# EAGLE design TLCduino (EAGLE 6.0)
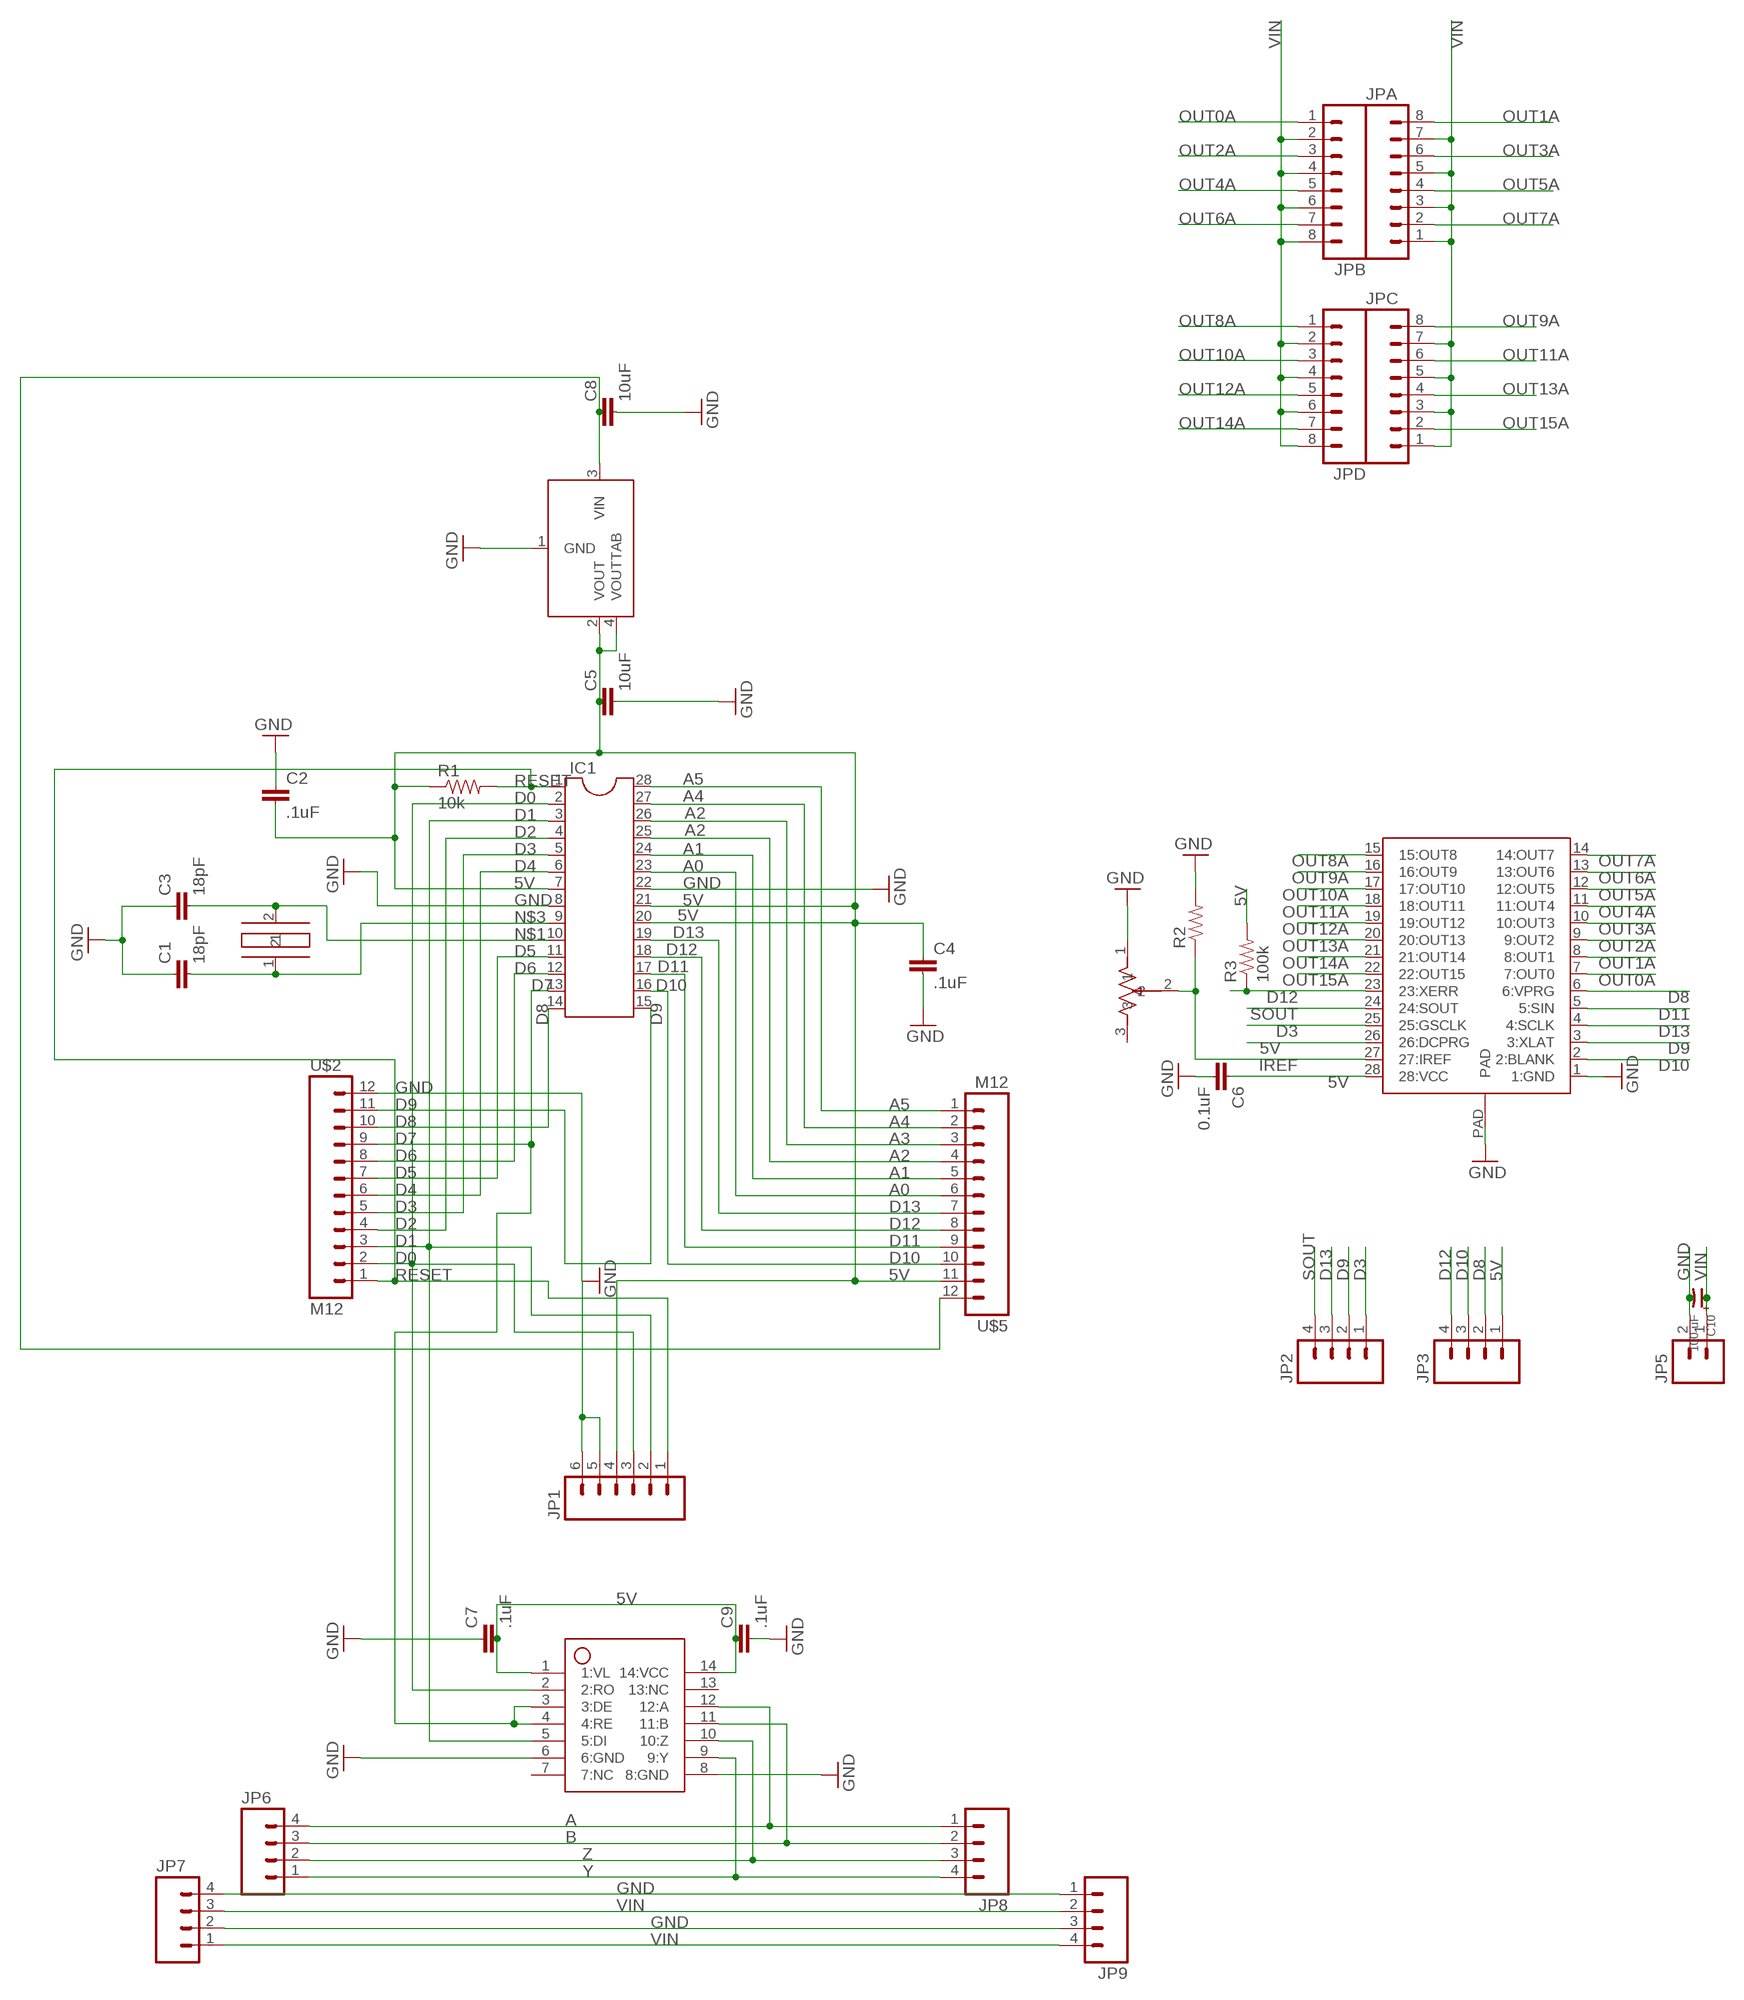
[diagram p0: schematic, sheet 1]

## Parts
5V  ZLDO1117  [ZLDO1117]
C1  18pF  CAP0603-CAP  [0603-CAP]
C2  .1uF  CAP0805  [0805]
C3  18pF  CAP0603-CAP  [0603-CAP]
C4  .1uF  CAP0805  [0805]
C5  10uF  CAP1206  [1206]
C6  0.1uF  CAP0805  [0805]
C7  .1uF  CAP0805  [0805]
C8  10uF  CAP1206  [1206]
C9  .1uF  CAP0805  [0805]
C10  100 uF  CAPPOL-5X11  [5X11MMCAP]
IC1  DIL28-3  [DIL28-3]
JP1  M06LOCK  [1X06_LOCK]
JP2  M04LOCK  [1X04_LOCK]
JP3  M04LOCK  [1X04_LOCK]
JP5  M02LOCK  [1X02_LOCK]
JP6  M04LOCK  [1X04_LOCK]
JP7  M04LOCK  [1X04_LOCK]
JP8  M04LOCK  [1X04_LOCK]
JP9  M04LOCK  [1X04_LOCK]
JPA  M08LOCK  [1X08_LOCK]
JPB  M08LOCK  [1X08_LOCK]
JPC  M08LOCK  [1X08_LOCK]
JPD  M08LOCK  [1X08_LOCK]
R1  10k  RESISTOR  [0805]
R2  RESISTOR  [0805]
R3  100k  RESISTOR  [0805]
U$1  HC49US  [HC49US]
U$2  M12  M12LOCK  [1X12_LOCK]
U$3  TLC5940  [HTSSOP-28]
U$4  TRIMPOTTC33X-2  [TC33X-2]
U$5  M12  M12LOCK  [1X12_LOCK]
U$6  MAX13432  [SO14]

## Nets
5V: 5V.2(VOUT) 5V.4(VOUTTAB) C2.2 C4.1 C5.1 C6.1 C7.2 C9.1 IC1.7 IC1.20 IC1.21 JP1.4 JP3.1 R1.1 R3.2 U$3.26(26:DCPRG) U$3.28(28:VCC) U$5.11 U$6.1(1:VL) U$6.14(14:VCC)
A: JP6.4 JP8.1 U$6.12(12:A)
A0: IC1.23 U$5.6
A1: IC1.24 U$5.5
A2: IC1.25 U$5.4
A3: IC1.26 U$5.3
A4: IC1.27 U$5.2
A5: IC1.28 U$5.1
B: JP6.3 JP8.2 U$6.11(11:B)
D0: IC1.2 JP1.3 U$2.2 U$6.2(2:RO)
D1: IC1.3 JP1.2 U$2.3 U$6.5(5:DI)
D2: IC1.4 U$2.4
D3: IC1.5 JP2.1 U$2.5 U$3.25(25:GSCLK)
D4: IC1.6 U$2.6
D5: IC1.11 U$2.7
D6: IC1.12 U$2.8
D7: IC1.13 U$2.9 U$6.3(3:DE) U$6.4(4:RE)
D8: IC1.14 JP3.2 U$2.10 U$3.6(6:VPRG)
D9: IC1.15 JP2.2 U$2.11 U$3.3(3:XLAT)
D10: IC1.16 JP3.3 U$3.2(2:BLANK) U$5.10
D11: IC1.17 U$3.5(5:SIN) U$5.9
D12: IC1.18 JP3.4 R3.1 U$3.23(23:XERR) U$5.8
D13: IC1.19 JP2.3 U$3.4(4:SCLK) U$5.7
GND: 5V.1(GND) C1.1 C2.1 C3.1 C4.2 C5.2 C6.2 C7.1 C8.2 C9.2 C10.- IC1.8 IC1.22 JP1.5 JP1.6 JP5.2 JP7.2 JP7.4 JP9.1 JP9.3 R2.2 U$2.12 U$3.1(1:GND) U$3.PAD U$4.1 U$6.6(6:GND) U$6.8(8:GND)
IREF: R2.1 U$3.27(27:IREF) U$4.2
N$1: C3.2 IC1.10 U$1.2
N$3: C1.2 IC1.9 U$1.1
OUT0A: JPB.1 U$3.7(7:OUT0)
OUT1A: JPA.8 U$3.8(8:OUT1)
OUT2A: JPB.3 U$3.9(9:OUT2)
OUT3A: JPA.6 U$3.10(10:OUT3)
OUT4A: JPB.5 U$3.11(11:OUT4)
OUT5A: JPA.4 U$3.12(12:OUT5)
OUT6A: JPB.7 U$3.13(13:OUT6)
OUT7A: JPA.2 U$3.14(14:OUT7)
OUT8A: JPD.1 U$3.15(15:OUT8)
OUT9A: JPC.8 U$3.16(16:OUT9)
OUT10A: JPD.3 U$3.17(17:OUT10)
OUT11A: JPC.6 U$3.18(18:OUT11)
OUT12A: JPD.5 U$3.19(19:OUT12)
OUT13A: JPC.4 U$3.20(20:OUT13)
OUT14A: JPD.7 U$3.21(21:OUT14)
OUT15A: JPC.2 U$3.22(22:OUT15)
RESET: IC1.1 JP1.1 R1.2 U$2.1
SOUT: JP2.4 U$3.24(24:SOUT)
VIN: 5V.3(VIN) C8.1 C10.+ JP5.1 JP7.1 JP7.3 JP9.2 JP9.4 JPA.1 JPA.3 JPA.5 JPA.7 JPB.2 JPB.4 JPB.6 JPB.8 JPC.1 JPC.3 JPC.5 JPC.7 JPD.2 JPD.4 JPD.6 JPD.8 U$5.12
Y: JP6.1 JP8.4 U$6.9(9:Y)
Z: JP6.2 JP8.3 U$6.10(10:Z)
Unconnected: U$4.3 U$6.7(7:NC) U$6.13(13:NC)

## Library data of the parts
5V = 1dah:ZLDO1117
C1-C9 = 1dah:CAP: Capacitor Standard 0402 ceramic capacitor, and 0.1" leaded capacitor.
C10 = 1dah:CAPPOL
IC1 = 1dah:DIL28: Dual In Line
JP1 = 1dah:M06: Header 6 Standard 6-pin 0.1" header. Use with straight break away headers (SKU : PRT-00116), right angle break away headers (PRT-00553), swiss pins (PRT-00743), machine pins (PRT-00117), and female headers (PRT-00115). Molex polarized connector foot print use with SKU : PRT-08094 with associated crimp pins and housings. NOTES ON THE VARIANTS LOCK and LOCK_LONGPADS... This footprint was designed to help hold the alignment of a through-hole component (i.e. 6-pin header) while soldering it into place. You may notice that each hole has been shifted either up or down by 0.005 of an inch from it's more standard position (which is a perfectly straight line). This slight alteration caused the pins (the squares in the middle) to touch the edges of the holes. Because they are alternating, it causes a "brace" to hold the component in place. 0.005 has proven to be the perfect amount of "off-center" position when using our standard breakaway headers. Although looks a little odd when you look at the bare footprint, once you have a header in there, the alteration is very hard to notice. Also, if you push a header all the way into place, it is covered up entirely on the bottom side. This idea of altering the position of holes to aid alignment will be further integrated into the Sparkfun Library for other footprints. It can help hold any component with 3 or more connection pins.
JP2 JP3 JP6-JP9 = 1dah:M04: Header 4 Standard 4-pin 0.1" header. Use with straight break away headers (SKU : PRT-00116), right angle break away headers (PRT-00553), swiss pins (PRT-00743), machine pins (PRT-00117), and female headers (PRT-00115). Molex polarized connector foot print use with SKU : PRT-08231 with associated crimp pins and housings.
JP5 = 1dah:M02: Header 2 Standard 2-pin 0.1" header. Use with straight break away headers (SKU : PRT-00116), right angle break away headers (PRT-00553), swiss pins (PRT-00743), machine pins (PRT-00117), and female headers (PRT-00115). Molex polarized connector foot print use with SKU : PRT-08233 with associated crimp pins and housings.
JPA JPB JPC JPD = 1dah:M08: Header 8 Standard 8-pin 0.1" header. Use with straight break away headers (SKU : PRT-00116), right angle break away headers (PRT-00553), swiss pins (PRT-00743), machine pins (PRT-00117), and female headers (PRT-00115).
R1-R3 = 1dah:RESISTOR: Resistor Basic schematic elements and footprints for 0603, 1206, and PTH 1/10th watt (small) resistors.
U$1 = 1dah:HC49US: 16 MHz crystal
U$2 U$5 = 1dah:M12: Header 12 Standard 12-pin 0.1" header. Use with straight break away headers (SKU : PRT-00116), right angle break away headers (PRT-00553), swiss pins (PRT-00743), machine pins (PRT-00117), and female headers (PRT-00115).
U$3 = 1dah:TLC5940
U$4 = 1dah:TRIMPOT: Bournes Trimpot
U$6 = 1dah:MAX13432: Full duplex RS285 interface

## Board
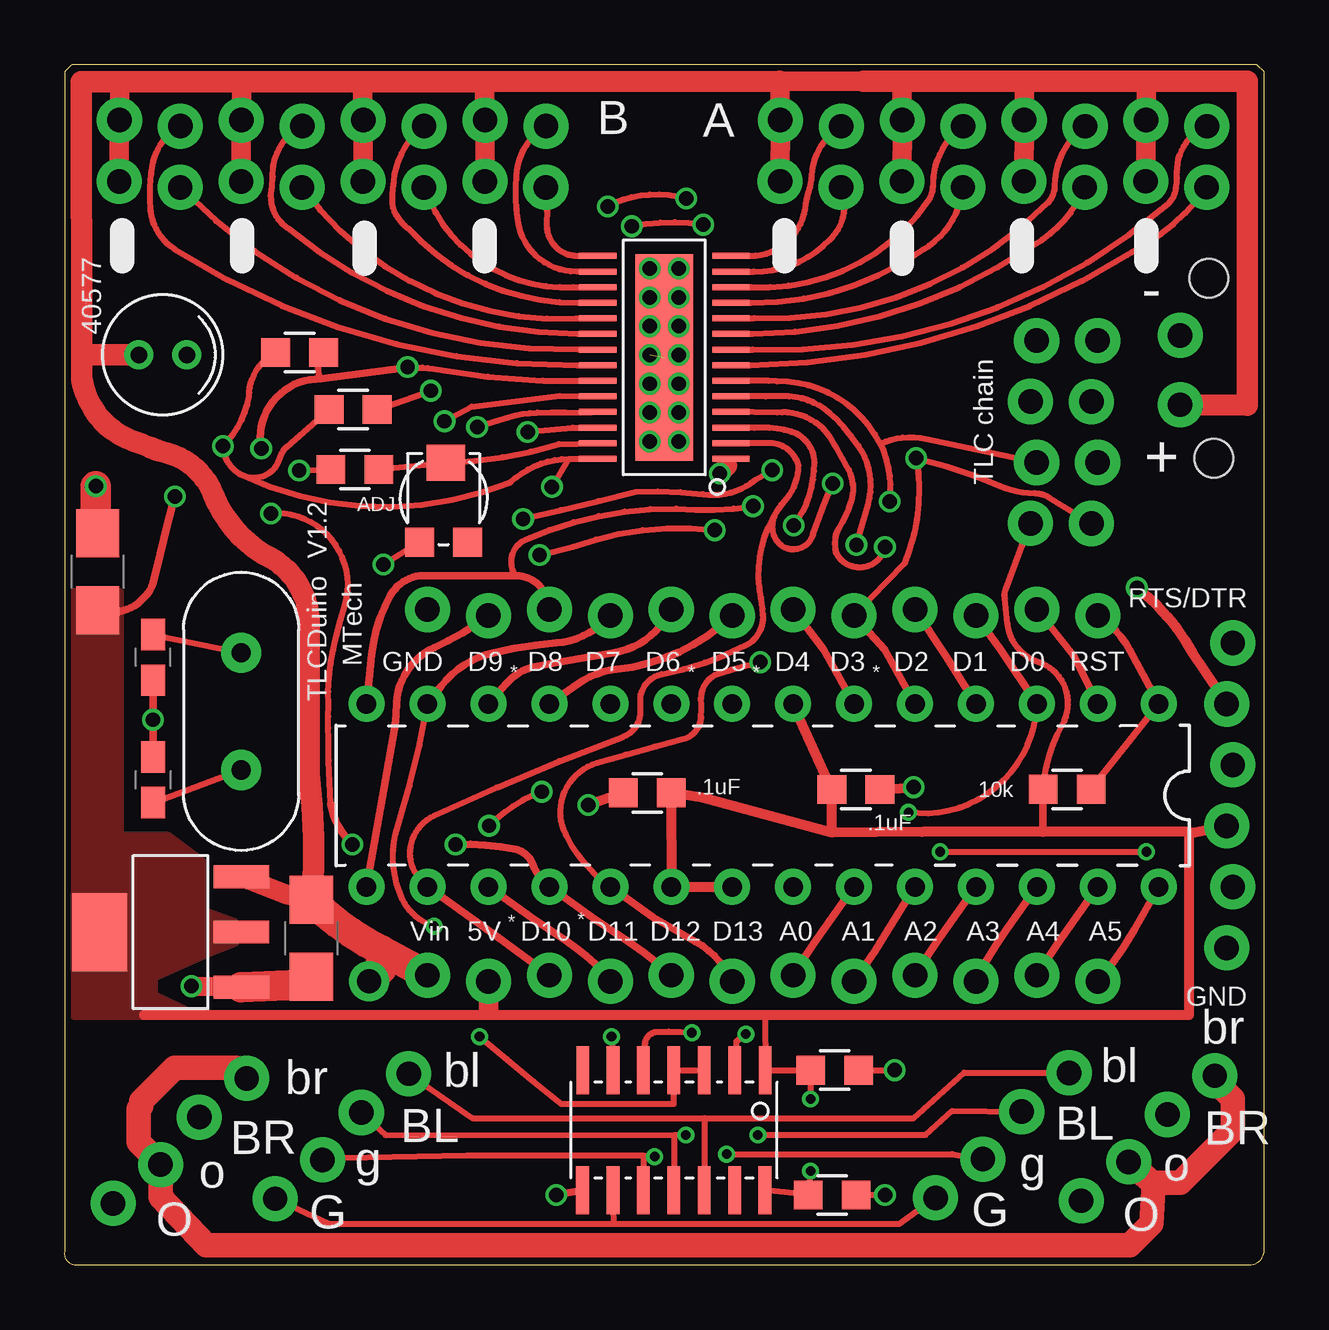
[diagram p1: board, top side]
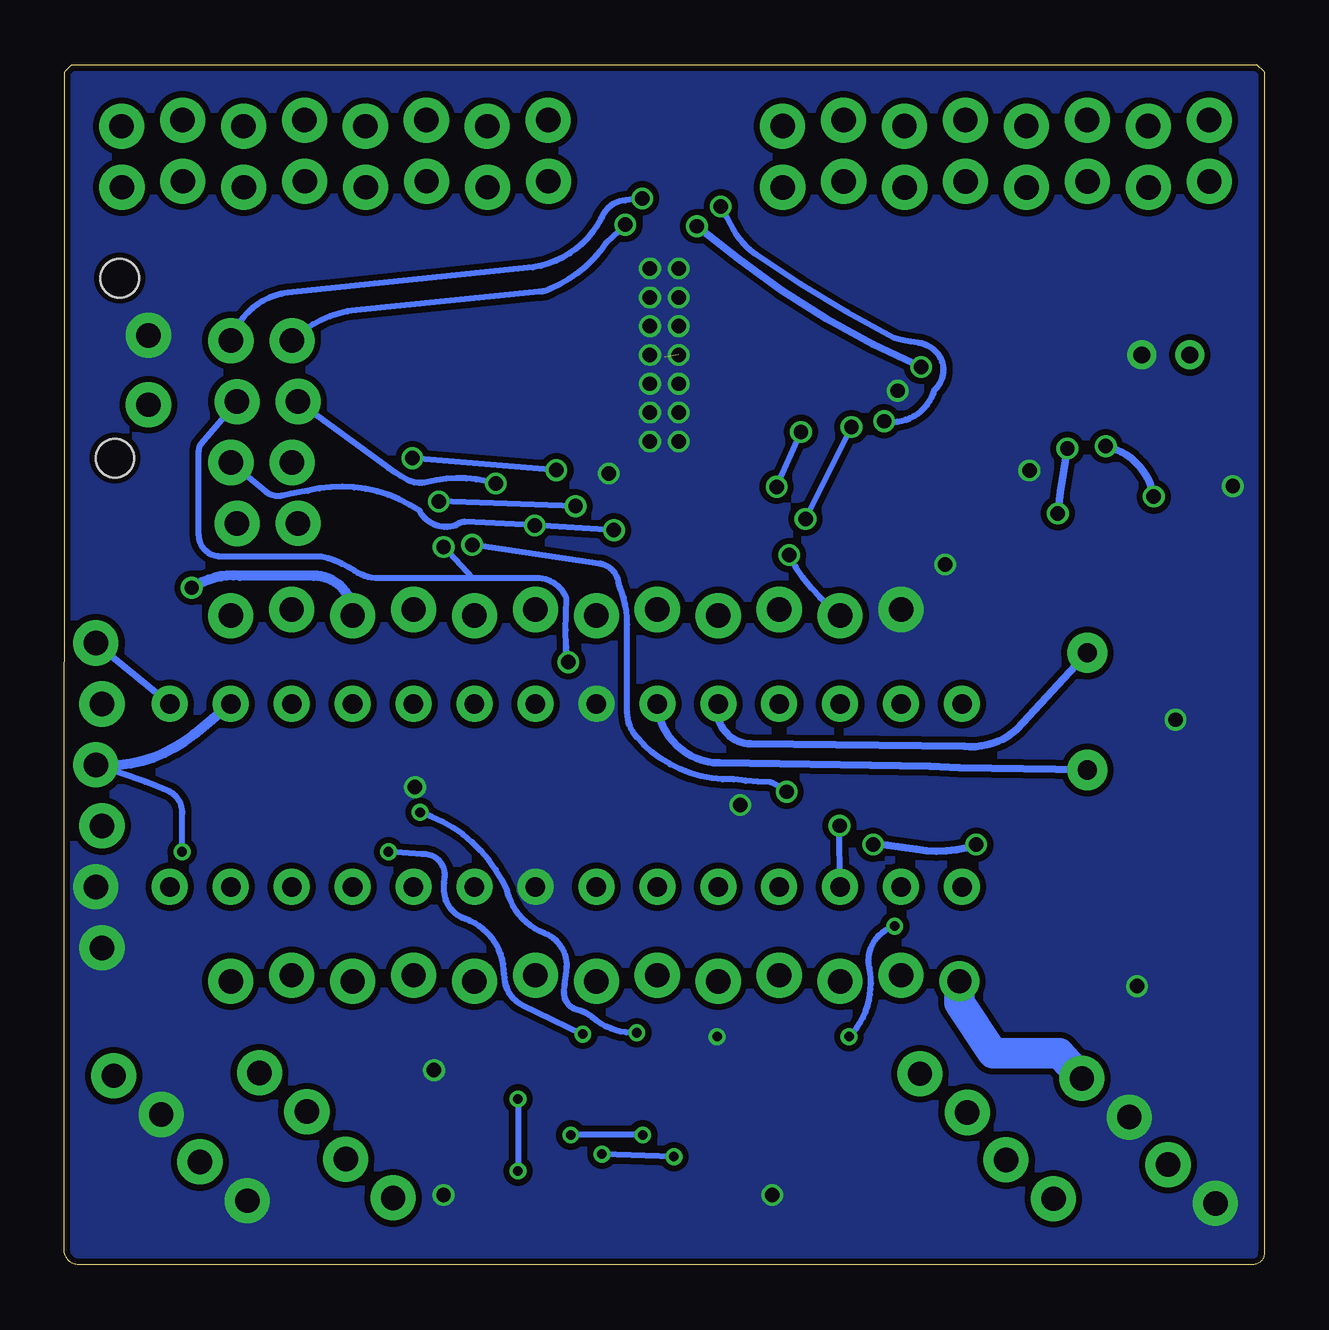
[diagram p2: board, bottom side, seen from below]

Size 50.01 x 50.01 mm. Coordinates in mm from the lower left corner, seen from the top.
Outline: 0,49.71 0.01,0.54 arc93 0.41,0.01 49.3,0.01 arc90 50.01,0.52 50,49.71
Outline: 49.71,50.01 0.31,50.01
Outline: 0,49.71 0.3,50.01
Outline: 49.7,50.01 50,49.71
Copper layers (1*16): Top 0.035mm / dielectric 1.5mm / Bottom 0.035mm
Design rules: minimum track width 6mil, minimum drill 12mil, track to track 6mil, track to pad 6mil, pad to pad 6mil, via to via 6mil, smd to smd 0mil, copper to edge 10mil, drill to drill 10mil, minimum pad ring 10mil, minimum via ring 6mil, stop-mask expansion 2mil, vias tented up to drill 100mil, thermal gap 10mil
Holes 1.6 mm at 47.7,41.11 47.9,33.61

### Footprints (pad centres in the part's own frame; a part is rotated, then mirrored left to right if it is on the bottom)
ZLDO1117 = smd 0.95 x 2.3: 1 -2.3,-3; 2 0,-3; 3 2.3,-3 | smd 3.25 x 2.3: 4 0,2.9
0603-CAP = smd 1.3 x 1: 1 -0.95,0; 2 0.95,0
0805 = smd 1.2 x 1.2: 1 -1,0; 2 1,0
1206 = smd 2 x 1.8: 1 -1.6,0; 2 1.6,0
5X11MMCAP = drill 0.7: + 0,-1; - 0,1
DIL28-3 = drill 0.813 pad 1.5: 1 -16.51,-3.81; 2 -13.97,-3.81; 3 -11.43,-3.81; 4 -8.89,-3.81; 5 -6.35,-3.81; 6 -3.81,-3.81; 7 -1.27,-3.81; 8 1.27,-3.81; 9 3.81,-3.81; 10 6.35,-3.81; 11 8.89,-3.81; 12 11.43,-3.81; 13 13.97,-3.81; 14 16.51,-3.81; 15 16.51,3.81; 16 13.97,3.81; 17 11.43,3.81; 18 8.89,3.81; 19 6.35,3.81; 20 3.81,3.81; 21 1.27,3.81; 22 -1.27,3.81; 23 -3.81,3.81; 24 -6.35,3.81; 25 -8.89,3.81; 26 -11.43,3.81; 27 -13.97,3.81; 28 -16.51,3.81
1X06_LOCK = drill 1.016 pad 1.88: 1 0,0.127; 2 2.54,-0.127; 3 5.08,0.127; 4 7.62,-0.127; 5 10.16,0.127; 6 12.7,-0.127
1X04_LOCK = drill 1.016 pad 1.88: 1 0,0.127; 2 2.54,-0.127; 3 5.08,0.127; 4 7.62,-0.127
1X02_LOCK = drill 1.016 pad 1.88: 1 -0.178,0; 2 2.718,0
1X08_LOCK = drill 1.016 pad 1.88: 1 0,0.127; 2 2.54,-0.127; 3 5.08,0.127; 4 7.62,-0.127; 5 10.16,0.127; 6 12.7,-0.127; 7 15.24,0.127; 8 17.78,-0.127
HC49US = drill 0.8 pad 1.676: 1 -2.44,0; 2 2.44,0
1X12_LOCK = drill 1.016 pad 1.88: 1 0,0.127; 2 2.54,-0.127; 3 5.08,0.127; 4 7.62,-0.127; 5 10.16,0.127; 6 12.7,-0.127; 7 15.24,0.127; 8 17.78,-0.127; 9 20.32,0.127; 10 22.86,-0.127; 11 25.4,0.127; 12 27.94,-0.127
HTSSOP-28 = smd 0.25 x 1.55: 1 -4.225,-2.775; 2 -3.575,-2.775; 3 -2.925,-2.775; 4 -2.275,-2.775; 5 -1.625,-2.775; 6 -0.975,-2.775; 7 -0.325,-2.775; 8 0.325,-2.775; 9 0.975,-2.775; 10 1.625,-2.775; 11 2.275,-2.775; 12 2.925,-2.775; 13 3.575,-2.775; 14 4.225,-2.775; 15 4.225,2.775; 16 3.575,2.775; 17 2.925,2.775; 18 2.275,2.775; 19 1.625,2.775; 20 0.975,2.775; 21 0.325,2.775; 22 -0.325,2.775; 23 -0.975,2.775; 24 -1.625,2.775; 25 -2.275,2.775; 26 -2.925,2.775; 27 -3.575,2.775; 28 -4.225,2.775 | smd 8.6 x 2.4: PAD 0,0
TC33X-2 = smd 1.2 x 1.2: 1 -1,-1.8; 3 1,-1.8 | smd 1.6 x 1.5: 2 0.1,1.5
SO14 = smd 0.53 x 2: 1 -3.81,-2.5; 2 -2.54,-2.5; 3 -1.27,-2.5; 4 0,-2.5; 5 1.27,-2.5; 6 2.54,-2.5; 7 3.8,-2.5; 8 3.81,2.5; 9 2.54,2.5; 10 1.27,2.5; 11 0,2.5; 12 -1.27,2.5; 13 -2.54,2.5; 14 -3.8,2.5

### Placement (x,y rotation side)
5V  4.38,13.86 90 top
C1  3.69,20.21 270 top
C2  24.29,19.66 0 top
C3  3.69,25.31 90 top
C4  32.99,19.8 0 top
C5  1.39,28.88 90 top
C6  12.03,35.63 0 top
C7  32,2.91 180 top
C8  10.29,13.6 270 top
C9  32.1,8.11 0 top
C10  4.1,37.91 270 top
IC1  29.11,19.56 180 top
JP1  48.57,25.91 270 top
JP2  42.94,30.89 90 top
JP3  40.4,30.89 90 top
JP5  46.51,36.01 90 top
JP6  36.4,2.7 45 top
JP7  47.86,7.97 225 top
JP8  14.26,8.05 225 top
JP9  2.12,2.47 45 top
JPA  29.84,47.57 0 top
JPB  47.61,45.02 180 top
JPC  2.29,47.57 0 top
JPD  20.07,45.02 180 top
R1  41.79,19.81 0 top
R2  12.1,33.14 180 top
R3  9.8,38.01 180 top
U$1  7.37,23.06 90 top
U$2  43.08,27.18 180 top
U$3  25,37.81 90 top
U$4  15.8,31.91 0 top
U$5  43.08,11.94 180 top
U$6  25.4,5.61 180 top

### Tracks (layer width: path | path; a pad name or v marks a point on that pad's centre or on a via)
5V  (via drill 0.4, 0.6)
  Top 0.254: 21.02,33.58 U$3.28 | 21.02,33.58 arc43 18.6,32.61 arc-47 7.4,32.91 | 7.4,32.91 arc-62 v6.6,34.11 arc36 7.7,36.16 arc-63 R3.2 | JP3.1 39.21,28.08 arc38 39.2,27.76 39.31,26.72 arc65 40.6,25.11 arc-101 41.6,22.51 arc25 R1.1 | C6.1 9.28,34.09 arc33 8.98,33.62 arc-100 7.4,32.91 | U$3.26 21.18,34.88 v19.31,34.7 | 21.02,33.58 v20.32,32.41 | U$6.14 C7.2 v31.1,3.91 | v31.1,6.91 C9.1 U$6.1 29.2,10.41
  Top 0.305: 40.79,18.03 R1.1 | v4.6,32.01 arc2 3.7,28.41 arc-87 C5.1
  Top 0.406: 46.89,18.03 40.79,18.03 35.76,18.03 31.99,18.01 | 46.89,18.03 46.89,10.41 29.2,10.41 17.42,10.41 | 3.31,10.41 17.42,10.41 | 31.99,18.01 C4.1 IC1.7 | IC1.21 IC1.20 C2.2 26.59,19.46 31.99,18.01 | JP1.4 47,18.01 46.89,18.03 | 17.42,10.41 arc53 17.68,10.62
  Top 0.813: 17.68,10.62 U$5.11
  Bottom 0.254: v20.32,32.41 v19.31,34.7 | v31.1,6.91 v31.1,3.91
  Bottom 0.305: v4.6,32.01 arc-68 v6.6,34.11
  pour Top (no thermals): 5.85,12.95 7.12,13.46 7.12,14.22 5.75,14.73 5.75,16.76 4.32,17.83 2.29,17.83 2.29,27.98 0.41,27.98 0.41,10.41 5.35,10.41 3.69,11.21 3.69,12.01
A
  Top 0.254: JP8.1 17,6.11 26.67,6.11 | 26.67,6.11 U$6.12 | 26.67,6.11 35.4,6.11 37.5,8.01 JP6.4
A0
  Top 0.305: IC1.23 31.65,13.97 arc4 U$5.6
A1
  Top 0.305: IC1.24 34.19,13.71 arc-3 U$5.5
A2
  Top 0.305: IC1.25 36.73,13.97 arc4 U$5.4
A3
  Top 0.305: IC1.26 39.27,13.97 arc10 U$5.3
A4
  Top 0.305: IC1.27 41.81,13.97 arc4 U$5.2
A5
  Top 0.305: IC1.28 44.6,13.97 arc-11 U$5.1
B  (via drill 0.4)
  Top 0.254: 25.41,5.41 U$6.11 | 25.41,5.41 13.38,5.4 JP8.2 | 25.41,5.41 v25.9,5.41 | v28.9,5.41 35.9,5.41 37,6.41 JP6.3
  Bottom 0.254: v25.9,5.41 v28.9,5.41
D0  (via drill 0.4)
  Top 0.254: U$6.2 28,9.31 v28.4,9.61 | v36.5,17.21 v45.1,17.21
  Top 0.305: IC1.2 42.06,25.4 U$2.2
  Bottom 0.254: v28.4,9.61 30.9,10.81 arc55 31.63,11.79 arc5 31.69,12.31 arc-67 33.3,14.41 arc68 34.18,15.59 arc10 34.16,16.08 arc-105 35.1,17.11 v36.5,17.21 | v45.1,17.21 45.1,18.71 arc-67 45.6,19.71 arc-6 JP1.3
  Bottom 0.406: IC1.2 44.6,22.11 arc44 JP1.3
D1  (via drill 0.4, 0.6)
  Top 0.254: U$6.5 24.2,9.21 arc-83 24.7,9.71 arc-7 v26.15,9.67 | v35.18,18.85 36,18.81 arc85 IC1.3
  Top 0.305: IC1.3 39.01,25.65 U$2.3
  Top 0.406: JP1.2 47,25.51 arc24 v44.7,28.21
  Bottom 0.254: v26.15,9.67 arc44 28,10.31 arc-28 28.6,10.61 arc80 29.17,11.36 arc6 29.08,12.24 arc-78 29.99,13.81 arc55 31.55,15.58 arc-49 v35.18,18.85
  Bottom 0.406: v44.7,28.21 arc38 42.7,28.71 39.6,28.71 arc92 U$2.3
D2
  Top 0.305: IC1.4 36.73,25.4 U$2.4
D3  (via drill 0.6)
  Top 0.254: U$2.5 35,29.21 arc33 v35.5,33.61 arc-10 39.23,32.36 arc18 40.43,32.15 arc-31 41.05,31.97 JP2.1 | v29.5,33.11 28.8,32.71 arc-49 26.6,32.11 arc10 23.8,32.21 arc-1 v19.12,31.08 | U$3.25 arc4 21.5,35.51 arc4 19.7,35.51 arc15 18.5,35.31 v17.2,34.91
  Top 0.305: IC1.5 34.19,25.65 U$2.5
  Bottom 0.254: v29.5,33.11 v35.5,33.61 | v17.2,34.91 v19.12,31.08
D4
  Top 0.305: IC1.6 31.65,25.65 U$2.6
D5
  Top 0.305: IC1.11 21.4,24.21 arc-30 23,24.81 arc38 U$2.7
D6
  Top 0.305: IC1.12 18.4,24.21 arc-38 19.6,24.91 arc-2 22.9,25.51 arc55 U$2.8
D7  (via drill 0.4)
  Top 0.254: U$6.3 U$6.4 25.4,6.71 20.7,6.71 arc-1 v17.3,9.51 | v15.4,14.11 arc-49 14.1,15.21 arc-43 13.9,18.31 arc9 IC1.13
  Top 0.305: IC1.13 15.7,24.11 arc-40 17.9,25.51 arc-7 20.5,25.91 arc44 U$2.9
  Bottom 0.254: v15.4,14.11 arc-86 16.45,12.37 arc17 16.4,11.5 arc43 v17.3,9.51
D8  (via drill 0.6)
  Top 0.254: U$3.6 28.69,36.84 arc-4 29.7,36.81 arc-64 34,34.21 | v28.7,31.61 arc-14 25.5,31.51 arc24 19.2,30.21 arc97 18.8,28.71 | v34.4,31.81 arc35 34,34.21 | JP3.2 35.9,34.41 arc37 34,34.21
  Top 0.305: IC1.14 12.8,25.41 arc-24 13.6,27.91 arc-65 15.1,28.71 18.8,28.71 arc-90 U$2.10
  Bottom 0.254: v28.7,31.61 v34.4,31.81
D9  (via drill 0.6)
  Top 0.254: v19.8,29.57 21.2,29.91 arc-27 v27.1,30.61 | U$3.3 28.78,34.87 arc-22 30.3,34.71 arc-73 31.26,33.42 arc-37 v30.4,30.81
  Top 0.305: IC1.15 13.7,22.01 arc8 13.85,23.41 arc-64 15.4,25.71 arc13 U$2.11
  Bottom 0.254: U$2.11 arc25 v19.8,29.57 | v27.1,30.61 v30.4,30.81 33.31,30.96 arc-39 33.7,30.81 arc81 35.2,31.41 arc-48 39.86,32.25 arc-6 40.9,32.05 arc54 41.6,32.21 JP2.2
D10  (via drill 0.6)
  Top 0.254: IC1.16 arc-119 15.4,18.71 arc-5 23.3,22.01 arc64 24,22.91 24,23.51 arc-79 24.9,24.61 arc15 28.4,25.81 arc68 29.12,27.09 arc3 29.04,27.8 arc-51 30,31.81 | 30,31.81 arc43 30.6,33.31 arc74 29.38,34.24 arc0 28.93,34.24 U$3.2 | v32.02,32.55 31.6,31.51 arc4 31.2,30.41 arc-137 29.6,30.31 arc-51 29.6,31.21 arc-17 30,31.81
  Top 0.305: IC1.16 16.91,14.48 arc-1 U$5.10
  Bottom 0.254: JP3.3 36.5,33.21 arc-8 35.7,32.71 arc-41 34.9,32.61 | 34.9,32.61 arc31 v32.02,32.55 arc-31 34.9,32.61
D11  (via drill 0.6)
  Top 0.254: v33.01,30 33.5,31.71 arc51 33.1,34.11 arc10 32.1,35.31 arc46 29.94,36.19 arc-2 U$3.5 | v17.7,18.29 arc-26 v19.9,19.71
  Top 0.305: IC1.17 19.45,14.48 20.98,13.46 arc-18 U$5.9
  Bottom 0.254: IC1.17 v17.7,18.29 | v33.01,30 27.73,29.22 arc80 26.89,28.33 arc25 26.55,26.68 arc-1 26.55,23.03 arc-40 26.17,22 arc-51 22.1,20.22 arc-6 20.6,20.11 arc26 v19.9,19.71
D12  (via drill 0.6)
  Top 0.254: 11.1,19.21 arc-3 11,21.91 arc-1 11,23.31 arc-14 11.2,25.61 arc-6 11.7,27.51 arc110 v8.6,31.31 | R3.1 10.7,37.71 arc68 10.7,36.91 | v23.64,43.27 arc-21 v26.63,43.34 | 14.25,37.37 arc14 v14.3,37.41 | 14.45,37.37 arc-14 15.37,37.33 arc12 U$3.23
  Top 0.305: U$5.8 arc9 23.52,13.46 21.99,14.48 IC1.18 arc-32 19.5,16.71 arc58 18.8,17.31 arc14 v16.3,17.51 | v12,17.51 arc-36 11.1,19.21 | v8.2,34.01 arc-102 10.7,36.91 14.25,37.37 14.45,37.37
  Bottom 0.254: v26.63,43.34 27.44,42.57 arc34 29.72,40.69 arc32 30.23,40.54 37.85,39.78 arc-38 JP3.4
  Bottom 0.305: v16.3,17.51 arc8 14.5,17.31 arc-30 v12,17.51 | v8.6,31.31 arc4 v8.2,34.01 | v23.64,43.27 21.9,41.91 arc-15 v14.3,37.41
D13  (via drill 0.6)
  Top 0.254: IC1.19 arc-28 20.9,17.91 arc-100 22.2,20.91 arc-2 25.8,21.91 arc74 26.54,22.85 arc2 26.54,23.59 arc-68 27.2,24.61 arc-7 v29,25.11 | U$3.4 29.7,35.51 arc-60 31.9,34.51 arc-1 32.7,33.11 arc-43 32.8,31.81 arc-13 32.3,30.71 arc51 32.2,29.61 arc139 v34.2,29.91
  Top 0.305: IC1.19 24.53,14.48 26.31,13.46 arc-35 U$5.7
  Bottom 0.254: v29,25.11 arc81 29.1,25.51 arc-10 29.09,25.78 arc6 29.08,27.78 arc-62 30.2,28.61 33,28.61 | JP2.3 44.3,34.21 arc-44 44.4,33.91 44.4,30.41 arc-90 43.5,29.51 39.3,29.51 arc20 37.9,28.91 arc-33 36.9,28.61 33,28.61 | 33,28.61 v34.2,29.91
GND  (via drill 0.4, 0.6)  (1 unrouted)
  Top 0.254: 27.64,33.3 U$3.1 | v9.78,33.09 R2.2 | U$4.1 v13.3,29.18 | C6.2 v15.28,36.42 | C9.2 v34.6,8.11 | C7.1 v34.2,2.91 | v22.8,9.51 U$6.6
  Top 0.305: C1.1 v3.69,22.71 C3.1 | U$6.8 v20.5,2.91
  Top 0.406: C4.2 v35.39,19.9 | v21.84,19.16 C2.1
  Top 0.813: 5V.1 v5.29,11.61 | v27.31,32.97 27.64,33.3
  Top 1.27: 5V.1 9.81,11.66 C8.2 | C5.2 1.31,30.44 v1.31,32.44
  other vias: 24.4,41.51 25.6,41.51 24.4,40.31 25.6,40.31 24.4,39.11 25.6,39.11 24.4,37.91 25.6,37.91 24.4,36.71 25.6,36.71 24.4,35.51 25.6,35.51 24.4,34.31 25.6,34.31
  pour Bottom (isolate 0.254, no thermals): -5.08,-7.61 62.23,-7.61 62.33,52.4 -4.98,52.4
IREF
  Top 0.254: R2.1 U$4.2 arc15 20.6,34.19 U$3.27
N$1
  Top 0.254: C3.2 U$1.2
  Bottom 0.305: U$1.2 10.3,22.31 arc49 12.5,21.61 21.4,21.71 arc100 IC1.10
N$3
  Top 0.254: C1.2 U$1.1
  Bottom 0.305: U$1.1 12.7,20.71 arc-4 16.4,20.81 22.7,20.91 arc85 IC1.9
OUT0A
  Top 0.254: U$3.7 28.57,37.48 arc32 44.5,42.21 arc28 JPB.1
OUT1A
  Top 0.254: U$3.8 28.69,38.13 arc43 46,44.21 arc40 46.33,44.84 arc9 46.37,45.51 arc-68 JPA.8
OUT2A
  Top 0.254: U$3.9 28.68,38.79 arc34 40.4,42.51 arc40 JPB.3
OUT3A
  Top 0.254: U$3.10 28.75,39.44 arc47 41.01,44.27 arc42 41.28,44.95 arc-52 JPA.6
OUT4A
  Top 0.254: U$3.11 28.64,40.08 arc35 35.8,42.31 arc55 JPB.5
OUT5A
  Top 0.254: U$3.12 28.63,40.74 arc59 36.04,44.38 arc31 36.21,45 arc-54 JPA.4
OUT6A
  Top 0.254: U$3.13 28.73,41.38 arc46 31.9,42.71 arc69 JPB.7
OUT7A
  Top 0.254: U$3.14 28.6,42.04 arc86 30.9,44.21 arc-8 31.08,44.88 arc9 31.15,45.39 arc-55 JPA.2
OUT8A
  Top 0.254: U$3.15 21.38,42.04 arc-93 20.1,43.41 arc9 JPD.1
OUT9A
  Top 0.254: JPC.8 arc55 18.84,45.37 arc12 18.9,43.51 arc83 21.35,41.38 U$3.16
OUT10A
  Top 0.254: U$3.17 21.21,40.74 arc-74 JPD.3
OUT11A
  Top 0.254: JPC.6 arc48 13.73,45.14 arc18 13.7,44.01 arc35 14.3,43.21 arc48 21.43,40.08 U$3.18
OUT12A
  Top 0.254: U$3.19 21.31,39.43 arc-57 JPD.5
OUT13A
  Top 0.254: JPC.4 arc55 8.7,45.75 arc-6 8.6,44.51 arc58 9.3,43.21 arc39 21.39,38.79 U$3.20
OUT14A
  Top 0.254: U$3.21 21.41,38.14 arc-47 JPD.7
OUT15A
  Top 0.254: JPC.2 arc48 3.7,45.95 arc17 3.6,43.91 arc51 4.6,42.31 arc33 21.38,37.48 U$3.22
RESET
  Top 0.305: R1.2 IC1.1 44.4,25.61 arc29 U$2.1
  Bottom 0.305: IC1.1 JP1.1
SOUT  (via drill 0.6)
  Top 0.254: v15.84,35.15 16.98,35.76 20.64,36.21 U$3.24 | v22.65,44.1 22.91,44.25 arc-38 v25.92,44.43
  Bottom 0.254: JP2.4 arc64 40.7,40.51 30.48,41.56 arc-55 27.64,43.59 arc64 26.63,44.35 v25.92,44.43 | v15.84,35.15 arc-84 13.72,36.48 arc-72 13.47,37.76 arc-53 14.4,38.41 arc6 15.4,38.61 arc7 21.2,42.11 arc26 22.1,43.11 v22.65,44.1
VIN  (via drill 1 pad 1.68)
  Top 0.813: C8.1 9.29,15.41 5V.3 | 0.71,49.28 0.71,49.25 0.7,45.71 | JPD.2 JPC.7 17.5,49.28 | JPD.4 JPC.5 12.4,49.28 | JPD.6 JPC.3 7.4,49.28 | JPD.8 JPC.1 2.3,49.28 2.2,49.28 | 33.3,49.31 29.8,49.3 JPA.1 JPB.8 | JPB.6 JPA.3 34.9,49.31 | JPB.4 JPA.5 40,49.31 | JPB.2 JPA.7 45.1,49.31
  Top 0.89: 0.71,37.92 0.71,36.91 arc65 3.2,34.21 arc10 4.3,33.81 arc-53 6.2,32.11 arc37 8.3,29.61 arc-68 10.2,26.61 10.2,20.41 arc-13 C8.1 | 0.71,37.92 0.71,49.25 | 0.71,49.28 2.2,49.28 7.4,49.28 12.4,49.28 17.5,49.28 29.8,49.3 | 33.3,49.31 34.9,49.31 40,49.31 45.1,49.31 49.3,49.31 49.3,35.81 JP5.1 | 0.71,37.92 C10.+
  Top 1.016: JP7.1 47.95,7.66 48.7,6.91 48.7,5.61 46.5,3.41 45.4,3.41 | 45.4,3.41 45.34,3.41 JP7.3 | 45.4,3.41 45.3,1.71 44.4,0.81 5.9,0.81 4.01,2.81 JP9.2 4.01,4.21 3.1,5.11 3.1,6.51 3.2,6.61 3.2,6.81 4.6,8.21 7.16,8.21 JP9.4
  Top 1.27: 13.2,13.11 U$5.12 | 13.2,13.11 arc-19 C8.1 | 13.2,13.11 13.2,12.31 v12.7,11.81
  Bottom 1.27: v12.7,11.81 12.7,10.91 11.3,8.81 8.54,8.81 JP9.4
Y
  Top 0.254: 22.9,1.71 U$6.9 | 22.9,1.71 11,1.71 JP8.4 | JP6.1 34.8,1.71 22.9,1.71
Z  (via drill 0.4)
  Top 0.254: 24.13,4.56 U$6.10 | 24.13,4.56 16.77,4.56 11.59,4.47 JP8.3 | 24.13,4.56 v24.6,4.51 | v27.6,4.61 37,4.61 JP6.2
  Bottom 0.254: v24.6,4.51 v27.6,4.61

### Text on the board
tPlace: B | A | - | 40577 | + | TLC chain | ADJ | TLCDuino | V1.2 | MTech | RTS/DTR | GND | D9 | D8 | D7 | D6 | D5 | D4 | D3 | D2 | D1 | D0 | * | * | * | * | RST | * | * | Vin | 5V | D10 | D11 | D12 | D13 | A0 | A1 | A2 | A3 | A4 | A5 | GND | br | bl | br | bl | BR | BL | BL | BR | g | g | o | o | G | G | O | O